# EAGLE design test2SMPP-03 (EAGLE 8.2.1)
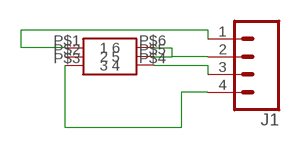
[diagram p0: schematic, sheet 1]

## Parts
J1  CONN_04  [1X04]
U$1  2SMPP-03  [2SMPP-03]

## Nets
N$1: J1.2 U$1.P$5 U$1.P$6
N$2: J1.1 U$1.P$1
N$3: J1.4 U$1.P$3
N$4: J1.3 U$1.P$4
Unconnected: U$1.P$2

## Library data of the parts
J1 = SparkFun-Connectors:CONN_04: Multi connection point. Often used as Generic Header-pin footprint for 0.1 inch spaced/style header connections On any of the 0.1 inch spaced packages, you can populate with these: Break Away Headers - Straight <https://www.sparkfun.com/products/116> (PRT-00116) Break Away Male Headers - Right Angle <https://www.sparkfun.com/products/553> (PRT-00553) Female Headers <https://www.sparkfun.com/products/115> (PRT-00115) Break Away Headers - Machine Pin <https://www.sparkfun.com/products/117> (PRT-00117) Break Away Female Headers - Swiss Machine Pin <https://www.sparkfun.com/products/743> (PRT-00743) For SCREWTERMINALS and SPRING TERMINALS visit here: Screw Terimnals on SparkFun.com <https://www.sparkfun.com/search/results?term=Screw+Terminals> (5mm/3.5mm/2.54mm spacing) This device is also useful as a general connection point to wire up your design to another part of your project. Our various solder wires solder well into these plated through hole pads. Hook-Up Wire - Assortment (Stranded, 22 AWG) <https://www.sparkfun.com/products/11375> (PRT-11375) Hook-Up Wire - Assortment (Solid Core, 22 AWG) <https://www.sparkfun.com/products/11367> (PRT-11367) View the entire wire category on our website here <https://www.sparkfun.com/categories/141> Special notes: Molex polarized connector foot print use with SKU : PRT-08231 with associated crimp pins and housings. 1MM SMD Version SKU: PRT-10208; PROD_ID: CONN-09696
U$1 = programmable-air-components:2SMPP-03

## Board
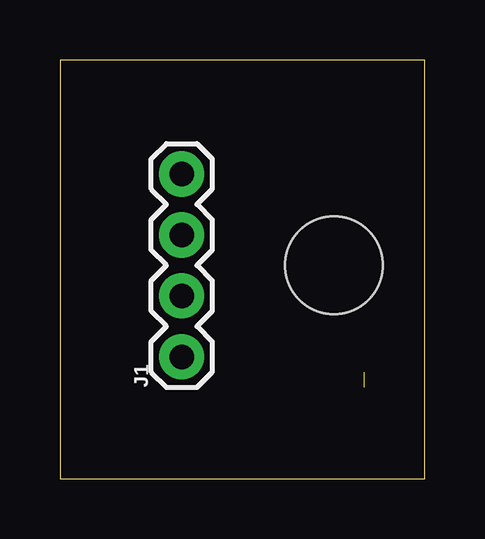
[diagram p1: board, top side]
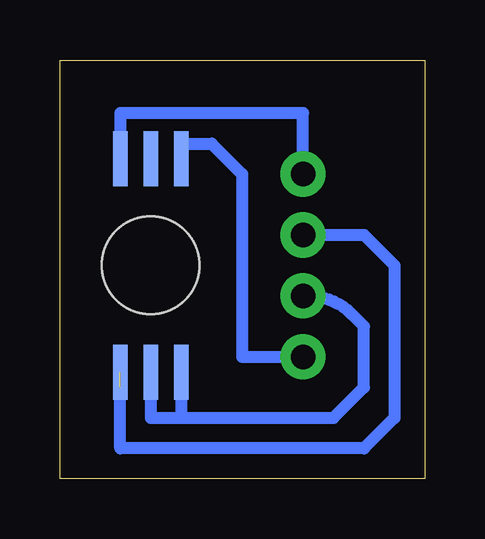
[diagram p2: board, bottom side, seen from below]

Size 15.22 x 17.45 mm. Coordinates in mm from the lower left corner, seen from the top.
Outline: 0,0 15.22,0 15.22,17.45 0,17.45 0,0
Copper layers (1*16): Top 0.035mm / dielectric 1.5mm / Bottom 0.035mm
Design rules "default": minimum track width 6mil, minimum drill 0.35mm, track to track 6mil, track to pad 6mil, pad to pad 6mil, via to via 6mil, smd to smd 6mil, copper to edge 40mil, drill to drill 6mil, minimum pad ring 10mil, minimum via ring 8mil, stop-mask expansion 4mil, vias tented up to drill 0mil, thermal gap 10mil

### Footprints (pad centres in the part's own frame; a part is rotated, then mirrored left to right if it is on the bottom)
1X04 = drill 1.016 pad 1.88: 1 0,0; 2 2.54,0; 3 5.08,0; 4 7.62,0
2SMPP-03 = smd 2.286 x 0.61 bottom: P$1 4.445,1.27; P$2 4.445,0; P$3 4.445,-1.27; P$4 -4.445,-1.27; P$5 -4.445,0; P$6 -4.445,1.27 | hole 4.064: 0,0

### Placement (x,y rotation side)
J1  5.08,5.08 90 top
U$1  11.43,8.89 90 top

### Tracks (layer width: path | path; a pad name or v marks a point on that pad's centre or on a via)
N$1
  Bottom 0.508: U$1.P$5 11.43,2.54 10.16,2.54 | U$1.P$6 10.16,2.54 | J1.2 4.86,7.62 arc45 3.07,6.88 2.54,6.35 2.54,3.81 3.81,2.54 10.16,2.54
N$2
  Bottom 0.508: J1.1 7.62,5.08 7.62,12.7 8.89,13.97 10.16,13.97 U$1.P$1
N$3
  Bottom 0.508: J1.4 5.08,15.24 12.7,15.24 U$1.P$3
N$4  (1 unrouted)
  Bottom 0.508: J1.3 2.54,10.16 1.27,8.89 1.27,2.54 2.54,1.27 12.7,1.27 12.7,3.81